# EAGLE design MPL3115A2_v10sch (EAGLE 6.2)
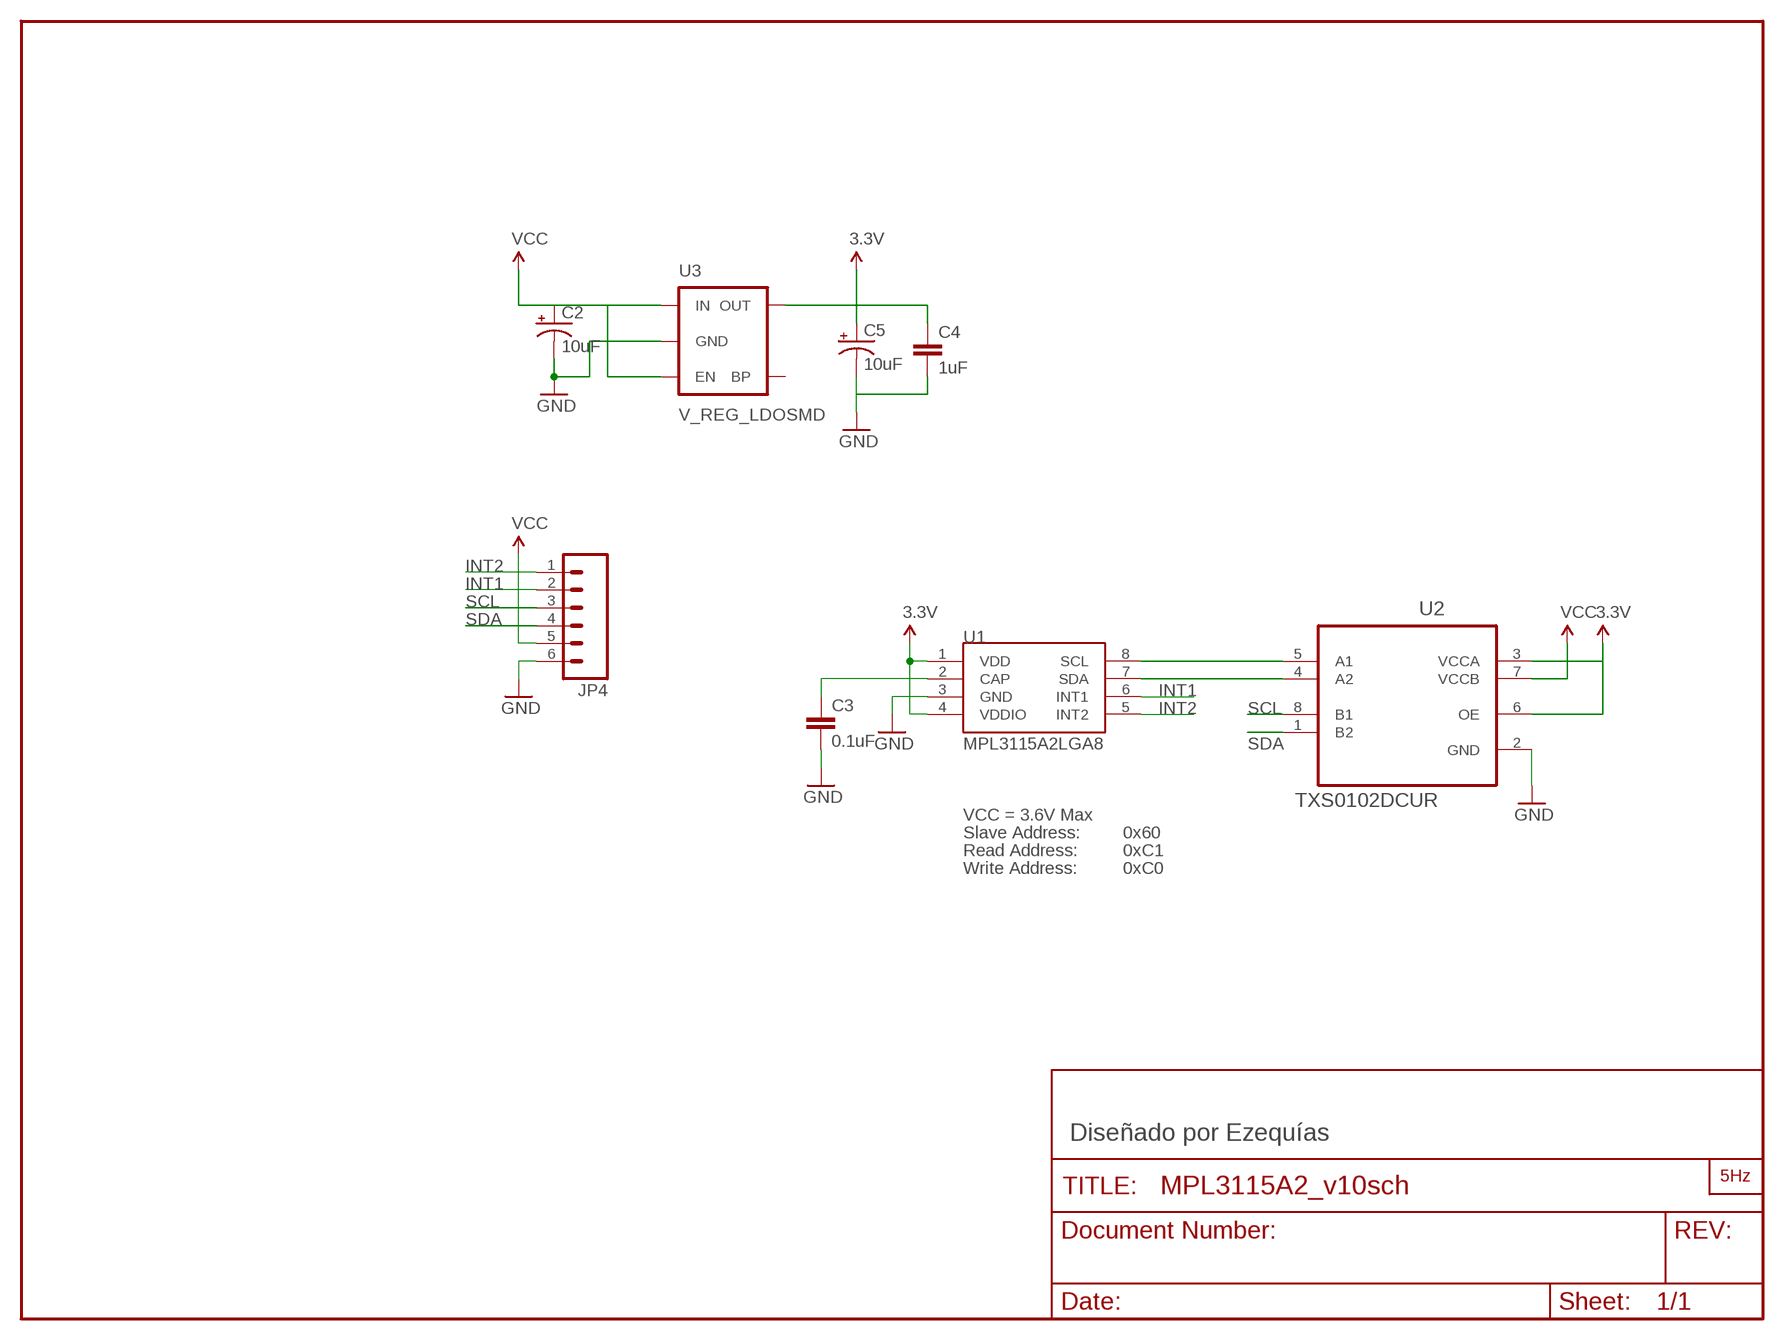
[diagram p0: schematic, sheet 1]

## Parts
C2  10uF  CAP_POL1206  [EIA3216]
C3  0.1uF  CAP0402-CAP  [0402-CAP]
C4  1uF  CAP0402-CAP  [0402-CAP]
C5  10uF  CAP_POL1206  [EIA3216]
JP4  M06SIP  [1X06]
U1  MPL3115A2LGA8  [LGA8]
U2  TXS0102DCUR  [SOP50P310X90-8N]
U3  V_REG_LDOSMD  [SOT23-5]
U$2  LOGO2_SILK5MM  [LOGO2_5MM]

## Nets
3.3V: C4.1 C5.A(+) U1.1(VDD) U1.4(VDDIO) U2.3(VCCA) U2.6(OE) U3.5(OUT)
GND: C2.C(-) C3.2 C4.2 C5.C(-) JP4.6 U1.3(GND) U2.2(GND) U3.2(GND)
INT1: JP4.2 U1.6(INT1)
INT2: JP4.1 U1.5(INT2)
N$3: C3.1 U1.2(CAP)
N$4: U1.8(SCL) U2.5(A1)
N$5: U1.7(SDA) U2.4(A2)
SCL: JP4.3 U2.8(B1)
SDA: JP4.4 U2.1(B2)
VCC: C2.A(+) JP4.5 U2.7(VCCB) U3.1(IN) U3.3(EN)
Unconnected: U3.4(BP)

## Notes on the sheet
- VCC = 3.6V Max
- Slave Address: | 0x60
- Read Address: | 0xC1
- Write Address: | 0xC0
- Diseñado por Ezequías

## Library data of the parts
C2 C5 = SparkFun:CAP_POL: Capacitor Polarized These are standard SMD and PTH capacitors. Normally 10uF, 47uF, and 100uF in electrolytic and tantalum varieties. Always verify the external diameter of the through hole cap, it varies with capacity, voltage, and manufacturer. The EIA devices should be standard.
C3 C4 = SparkFun:CAP: Capacitor Standard 0603 ceramic capacitor, and 0.1" leaded capacitor.
JP4 = SparkFun:M06: Header 6 Standard 6-pin 0.1" header. Use with straight break away headers (SKU : PRT-00116), right angle break away headers (PRT-00553), swiss pins (PRT-00743), machine pins (PRT-00117), and female headers (PRT-00115). Molex polarized connector foot print use with SKU : PRT-08094 with associated crimp pins and housings. NOTES ON THE VARIANTS LOCK and LOCK_LONGPADS... This footprint was designed to help hold the alignment of a through-hole component (i.e. 6-pin header) while soldering it into place. You may notice that each hole has been shifted either up or down by 0.005 of an inch from it's more standard position (which is a perfectly straight line). This slight alteration caused the pins (the squares in the middle) to touch the edges of the holes. Because they are alternating, it causes a "brace" to hold the component in place. 0.005 has proven to be the perfect amount of "off-center" position when using our standard breakaway headers. Although looks a little odd when you look at the bare footprint, once you have a header in there, the alteration is very hard to notice. Also, if you push a header all the way into place, it is covered up entirely on the bottom side. This idea of altering the position of holes to aid alignment will be further integrated into the Sparkfun Library for other footprints. It can help hold any component with 3 or more connection pins.
U1 = SparkFun-Sensors:MPL3115A2: Altimeter/Pressure Sensor, I2C, 1.95V-3.6V supply, 50 to 110kPa
U2 = TXS0102D:TXS0102DCUR: 2-BIT BIDIRECTIONAL VOLTAGE-LEVEL TRANSLATOR FOR OPEN-DRAIN AND PUSH-PULL APPLICATIONS; MPN: TXS0102DCUR; OC_FARNELL: 1703315; OC_NEWARK: 30M1878; PACKAGE: SOP-8; SUPPLIER: Texas Instruments
U3 = SparkFun:V_REG_LDO: Voltage Regulator LDO Standard 150mA LDO voltage regulator in SOT-23 layout. Micrel part MIC5205. BP (by-pass) pin is used to lower output noise with 470pF cap.
U$2 = LOGO:LOGO2_SILK: PRINCIPAL

## Board
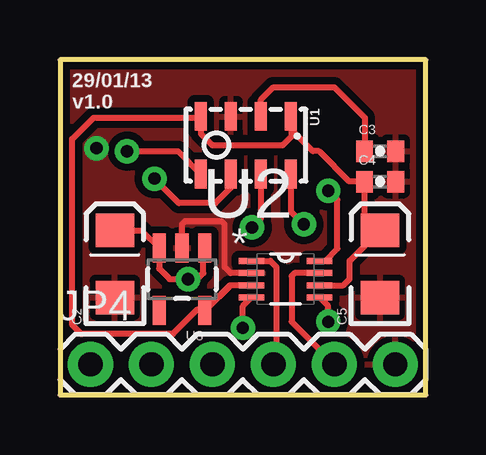
[diagram p1: board, top side]
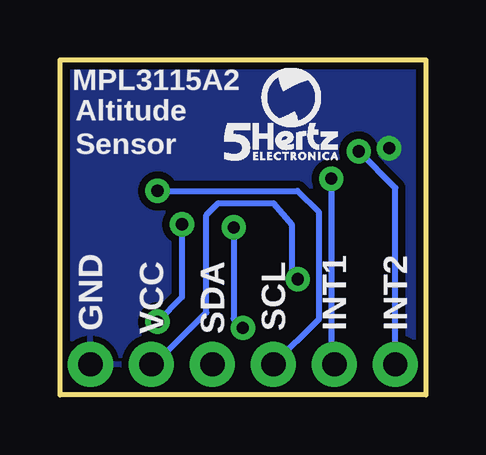
[diagram p2: board, bottom side, seen from below]

Size 15.24 x 13.97 mm. Coordinates in mm from the lower left corner, seen from the top.
Outline: 15.24,13.97 0,13.97 0,0 15.24,0 15.24,13.97
Copper layers (1*16): Top 0.035mm / dielectric 1.5mm / Bottom 0.035mm
Design rules: minimum track width 8mil, minimum drill 20mil, track to track 8mil, track to pad 8mil, pad to pad 8mil, via to via 8mil, smd to smd 8mil, copper to edge 10mil, drill to drill 8mil, minimum pad ring 12mil, minimum via ring 10mil, stop-mask expansion 4mil, vias tented up to drill 25mil, thermal gap 10mil

### Footprints (pad centres in the part's own frame; a part is rotated, then mirrored left to right if it is on the bottom)
EIA3216 = smd 1.4 x 1.6: A 1.4,0; C -1.4,0
0402-CAP = smd 0.7 x 0.9: 1 -0.65,0; 2 0.65,0
1X06 = drill 1.016 pad 1.88: 1 0,0; 2 2.54,0; 3 5.08,0; 4 7.62,0; 5 10.16,0; 6 12.7,0
LGA8 = smd 1.2 x 0.5: 1 -1.2,1.875; 2 -1.2,0.625; 3 -1.2,-0.625; 4 -1.2,-1.875; 5 1.2,-1.875; 6 1.2,-0.625; 7 1.2,0.625; 8 1.2,1.875
SOP50P310X90-8N = smd 1.067 x 0.254: 1 -1.422,0.762; 2 -1.422,0.254; 3 -1.422,-0.254; 4 -1.422,-0.762; 5 1.422,-0.762; 6 1.422,-0.254; 7 1.422,0.254; 8 1.422,0.762
SOT23-5 = smd 0.55 x 1.2: 1 -0.95,-1.3; 2 0,-1.3; 3 0.95,-1.3; 4 0.95,1.3; 5 -0.95,1.3

### Placement (x,y rotation side)
C2  2.29,5.46 90 top
C3  13.34,10.16 0 top
C4  13.34,8.89 0 top
C5  13.34,5.46 90 top
JP4  1.27,1.27 0 top
U1  7.75,10.41 270 top
U2  9.4,4.83 0 top
U3  5.08,4.83 180 top
U$2  8.38,9.78 0 bottom

### Tracks (layer width: path | path; a pad name or v marks a point on that pad's centre or on a via)
3.3V
  Top 0.254: 9.65,11.05 9.65,10.79 9.27,10.41 6.35,10.41 5.87,10.89 U1.4 5.82,11.56 1.4,11.56 0.51,10.67 0.51,2.92 0.89,2.54 4.7,2.54 5.71,3.56 6.1,3.56 7.11,4.57 U2.3 7.08,4.57 U3.5 | 9.65,11.05 9.65,11.58 U1.1 | U2.6 11.81,4.57 12.06,4.83 12.06,5.59 C5.A 12.69,7.51 C4.1 12.7,8.9 12.05,8.9 10.79,10.16 10.54,10.16 9.65,11.05
GND  (via drill 0.51)
  Top 0.254: 5.08,6.35 U3.2 5.08,7.11 5.21,7.24 6.73,7.24 6.86,7.11 6.86,5.33 7.11,5.08 U2.2
  other vias: 1.52,10.29
  pour Bottom (isolate 0.305): 15.24,0 15.24,13.97 0,13.97 0,0
  pour Top (isolate 0.305): 15.24,0 15.24,13.97 0,13.97 0,0
INT1  (via drill 0.51)
  Top 0.254: U1.6 7.12,8.65 6.48,8 4.95,8 v3.94,9.02
  Bottom 0.254: v3.94,9.02 3.94,1.4 JP4.2
INT2  (via drill 0.51)
  Top 0.254: v2.79,10.16 4.93,10.16 U1.5
  Bottom 0.254: JP4.1 1.27,8.64 v2.79,10.16
N$3
  Top 0.254: U1.2 8.37,12.31 8.89,12.83 11.43,12.83 12.7,11.56 12.7,10.18 C3.1
N$4  (via drill 0.51)
  Top 0.254: U1.8 9.62,7.65 v10.16,7.11 | v11.18,3.05 11.18,3.71 U2.5
  Bottom 0.254: v10.16,7.11 10.16,4.06 v11.18,3.05
N$5  (via drill 0.51)
  Top 0.254: U1.7 8.37,7.36 v8,6.99 | v7.62,2.79 7.62,3.71 U2.4
  Bottom 0.254: v8,6.99 8,3.17 v7.62,2.79
SCL  (via drill 0.51)
  Top 0.254: U2.8 11.05,5.59 11.56,6.1 11.56,8.13 v11.18,8.51
  Bottom 0.254: v11.18,8.51 5.33,8.51 4.45,7.62 4.45,3.17 JP4.3
SDA
  Top 0.254: U2.1 8.76,5.59 9.02,5.33 9.02,1.4 JP4.4
VCC  (via drill 0.51)
  Top 0.254: C2.A 3.4,6.86 U3.3 4.13,5.27 4.57,4.83 v5.33,4.83 5.71,4.83 5.97,5.08 5.97,6.07 U3.1 | U2.7 9.78,5.08 9.65,4.95 9.65,3.05 JP4.5
  Bottom 0.254: JP4.5 11.3,1.27 9.14,3.43 9.14,7.49 8.64,8 6.35,8 5.59,7.11 5.59,5.08 v5.33,4.83

### Text on the board
tPlace: 29/01/13 | v1.0
bPlace: MPL3115A2 | Altitude | Sensor | INT2 | INT1 | SCL | SDA | VCC | GND